# Altium schematic sheet GPI_IF.SchDoc
size A4; SheetNumber: 2; SheetTotal: 13
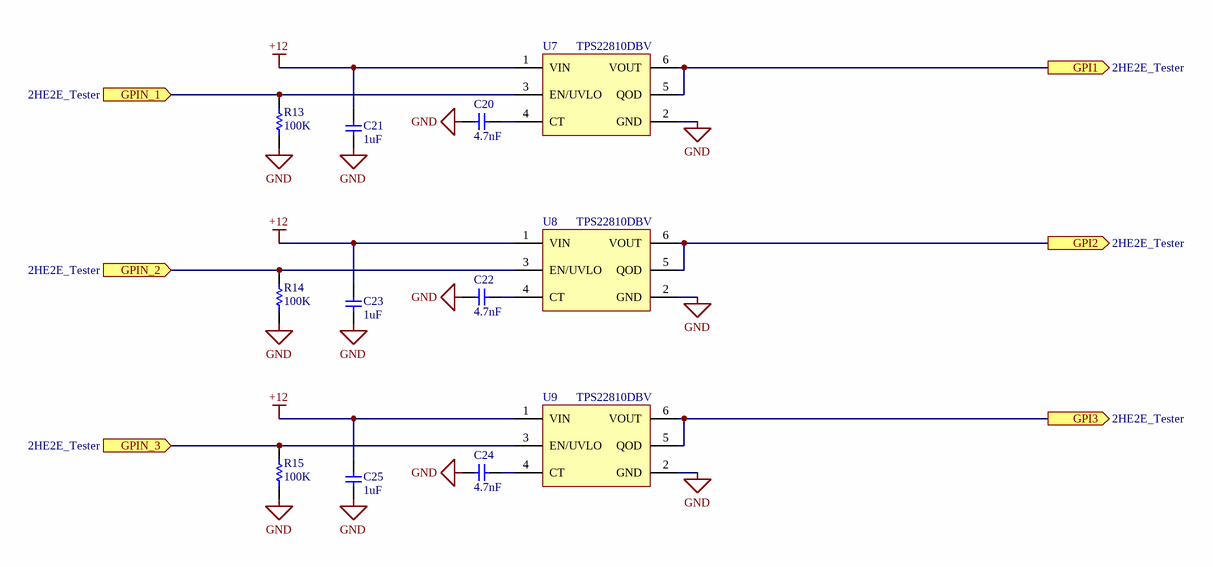
[diagram p0: GPI_IF.SchDoc]

## Parts
C20  value 4.7nF  [0603M-C]  (hidden comment: Cap Ceramic)
C21  value 1uF  [0603M-C]  (hidden comment: Cap Ceramic)
C22  value 4.7nF  [0603M-C]  (hidden comment: Cap Ceramic)
C23  value 1uF  [0603M-C]  (hidden comment: Cap Ceramic)
C24  value 4.7nF  [0603M-C]  (hidden comment: Cap Ceramic)
C25  value 1uF  [0603M-C]  (hidden comment: Cap Ceramic)
R13  value 100K  [0603M]  (hidden comment: Resistor)
R14  value 100K  [0603M]  (hidden comment: Resistor)
R15  value 100K  [0603M]  (hidden comment: Resistor)
U7  TPS22810DBV  [SOT23-6 (SOT26)]
U8  TPS22810DBV  [SOT23-6 (SOT26)]
U9  TPS22810DBV  [SOT23-6 (SOT26)]

## Ports
GPI1 (out, see 2HE2E_Tester), GPI2 (out, see 2HE2E_Tester), GPI3 (out, see 2HE2E_Tester), GPIN_1 (in, see 2HE2E_Tester), GPIN_2 (in, see 2HE2E_Tester), GPIN_3 (in, see 2HE2E_Tester)

## Nets
+12: C21.1 C23.1 C25.1 U7.1(VIN) U8.1(VIN) U9.1(VIN)
GND: C20.2 C21.2 C22.2 C23.2 C24.2 C25.2 R13.1 R14.1 R15.1 U7.2(GND) U8.2(GND) U9.2(GND)
GPI1: U7.5(QOD) U7.6(VOUT) ; port GPI1
GPI2: U8.5(QOD) U8.6(VOUT) ; port GPI2
GPI3: U9.5(QOD) U9.6(VOUT) ; port GPI3
GPIN_1: R13.2 U7.3(EN/UVLO) ; port GPIN_1
GPIN_2: R14.2 U8.3(EN/UVLO) ; port GPIN_2
GPIN_3: R15.2 U9.3(EN/UVLO) ; port GPIN_3
NetC20_1: C20.1 U7.4(CT)
NetC22_1: C22.1 U8.4(CT)
NetC24_1: C24.1 U9.4(CT)

## Notes on the sheet
- Title
- Size:
- Date:
- A4
- Number:
- Time:
- Revision:
- Sheet
- of
- File:

## Library data of the parts
C20 C22 C24 = Cap Ceramic: Ceramic Capacitor
C21 C23 C25 = Cap Ceramic: Ceramic Capacitor 16V
U7-U9 = TPS22810DBV: Load Switch With Thermal Protection 2.7-18-V, 79-mΩ On-Resistance